# EAGLE schematic main_board (EAGLE 9.2.1)

## Sheet 1 of 2: LOGIC
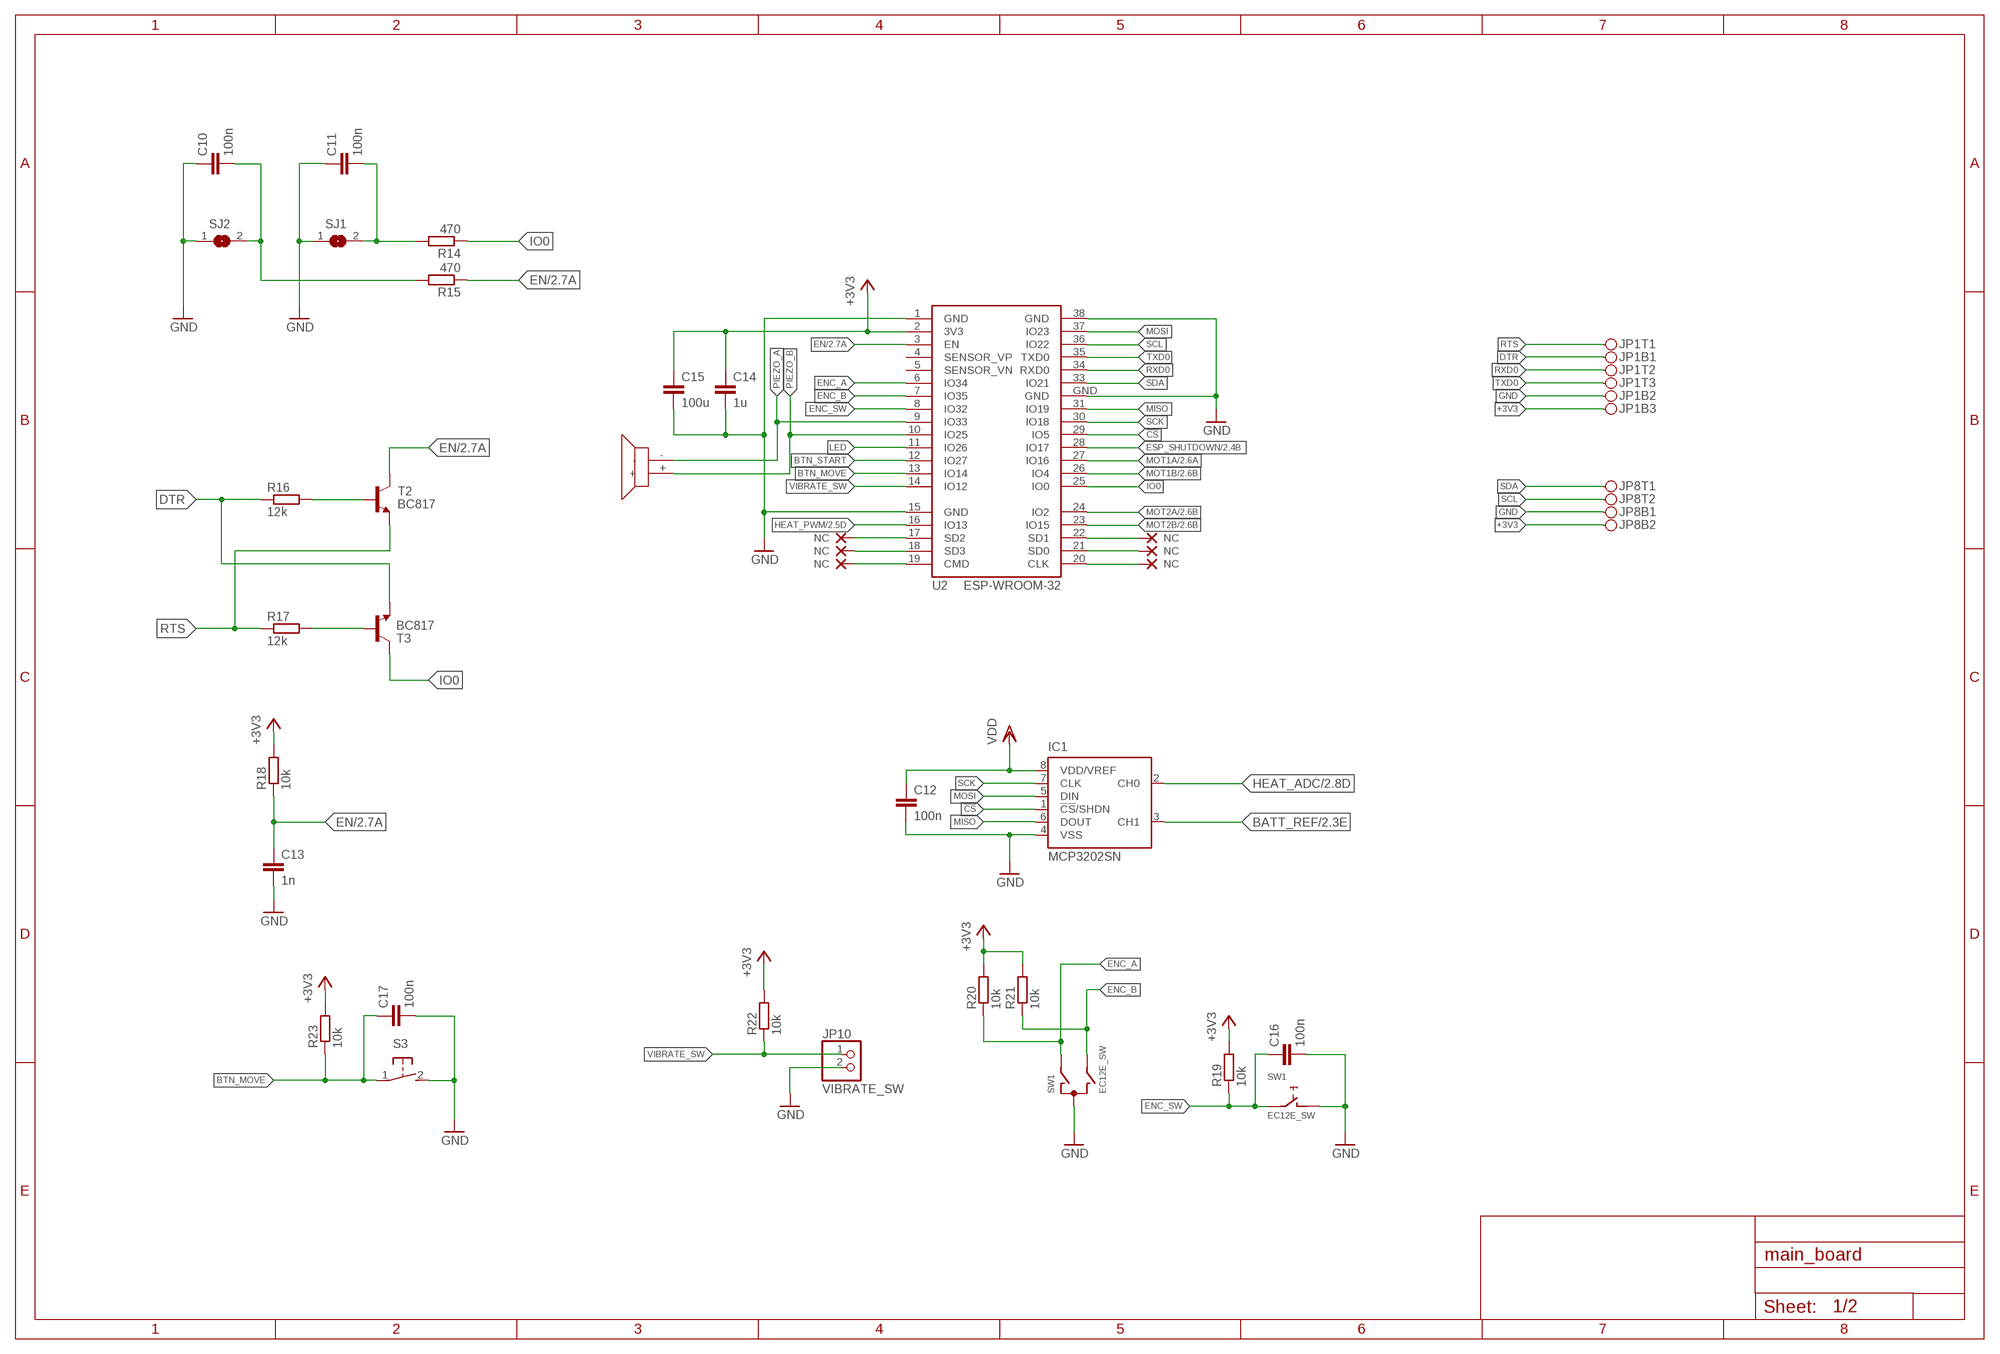
[diagram p0: schematic, sheet 1]

### Parts
C10  100n  C-EUC0603  [C0603]
C11  100n  C-EUC0603  [C0603]
C12  100n  C-EUC0603  [C0603]
C13  1n  C-EUC0603  [C0603]
C14  1u  C-EUC0603  [C0603]
C15  100u  C-EUC0603  [C0603]
C16  100n  C-EUC0603  [C0603]
C17  100n  C-EUC0603  [C0603]
IC1  MCP3202SN  [SO-08]
JP1  PINH2X03  [PINH2X03SMD]
JP8  PINH2X02  [PINH2X02SMD]
JP10  VIBRATE_SW  PINHD-1X2  [1X02]
NC2  NC  (no package)
NC3  NC  (no package)
NC4  NC  (no package)
NC5  NC  (no package)
NC6  NC  (no package)
NC7  NC  (no package)
R14  470  R-EU_R0603  [R0603]
R15  470  R-EU_R0603  [R0603]
R16  12k  R-EU_R0603  [R0603]
R17  12k  R-EU_R0603  [R0603]
R18  10k  R-EU_R0603  [R0603]
R19  10k  R-EU_R0603  [R0603]
R20  10k  R-EU_R0603  [R0603]
R21  10k  R-EU_R0603  [R0603]
R22  10k  R-EU_R0603  [R0603]
R23  10k  R-EU_R0603  [R0603]
S3  31-XX  [B3F-31XX]
SJ1  SJ  [SJ]
SJ2  SJ  [SJ]
SW1  EC12E_SW  [ALPS_EC12E_SW]
T2  BC817  BC817-25-NPN-SOT23-BEC  [SOT23-BEC]
T3  BC817  BC817-25-NPN-SOT23-BEC  [SOT23-BEC]
U2  ESP-WROOM-32  [ESP-WROOM-32]
U$1  PIEZO  [PIEZO]

### Nets
!CS: IC1.1(!CS!/SHDN) U2.29(IO5)
+3V3: C14.1 C15.1 JP1.B3 JP8.B2 R18.2 R19.2 R20.2 R21.2 R22.2 R23.2 U2.2(3V3) ; also sheet 2
BATT_REF: IC1.3(CH1) ; also sheet 2
BTN_MOVE: C17.1 R23.1 S3.1(P) U2.13(IO14)
BTN_START: U2.12(IO27)
DTR: JP1.B1 R16.1 T3.E
EN: C13.1 R15.1 R18.1 T2.C U2.3(EN) ; also sheet 2
ENC_A: R20.1 SW1.A U2.6(IO34)
ENC_B: R21.1 SW1.B U2.7(IO35)
ENC_SW: C16.1 R19.1 SW1.E U2.8(IO32)
ESP_SHUTDOWN: U2.28(IO17) ; also sheet 2
GND: C10.1 C11.1 C12.2 C13.2 C14.2 C15.2 C16.2 C17.2 IC1.4(VSS) JP1.B2 JP8.B1 JP10.2 S3.2(S) SJ1.1 SJ2.1 SW1.C SW1.D U2.1(GND) U2.15(GND) U2.38(GND) U2.GND ; also sheet 2
HEAT_ADC: IC1.2(CH0) ; also sheet 2
HEAT_PWM: U2.16(IO13) ; also sheet 2
IO0: R14.1 T3.C U2.25(IO0)
LED: U2.11(IO26)
MISO: IC1.6(DOUT) U2.31(IO19)
MOSI: IC1.5(DIN) U2.37(IO23)
MOT1A: U2.27(IO16) ; also sheet 2
MOT1B: U2.26(IO4) ; also sheet 2
MOT2A: U2.24(IO2) ; also sheet 2
MOT2B: U2.23(IO15) ; also sheet 2
N$12: R16.2 T2.B
N$20: C10.2 R15.2 SJ2.2
N$21: R17.2 T3.B
N$23: C11.2 R14.2 SJ1.2
N$24: NC5.NC U2.22(SD1)
N$25: NC2.NC U2.17(SD2)
N$26: NC3.NC U2.18(SD3)
N$27: NC4.NC U2.19(CMD)
N$28: NC6.NC U2.21(SD0)
N$29: NC7.NC U2.20(CLK)
PIEZO_A: U2.9(IO33) U$1.-
PIEZO_B: U2.10(IO25) U$1.+
RTS: JP1.T1 R17.1 T2.E
RXD0: JP1.T2 U2.34(RXD0)
SCK: IC1.7(CLK) U2.30(IO18)
SCL: JP8.T2 U2.36(IO22)
SDA: JP8.T1 U2.33(IO21)
TXD0: JP1.T3 U2.35(TXD0)
VDD: C12.1 IC1.8(VDD/VREF) ; also sheet 2
VIBRATE_SW: JP10.1 R22.1 U2.14(IO12)
Unconnected: SW1.GND1(G) SW1.GND2(G) U2.4(SENSOR_VP) U2.5(SENSOR_VN)

## Sheet 2 of 2: POWER
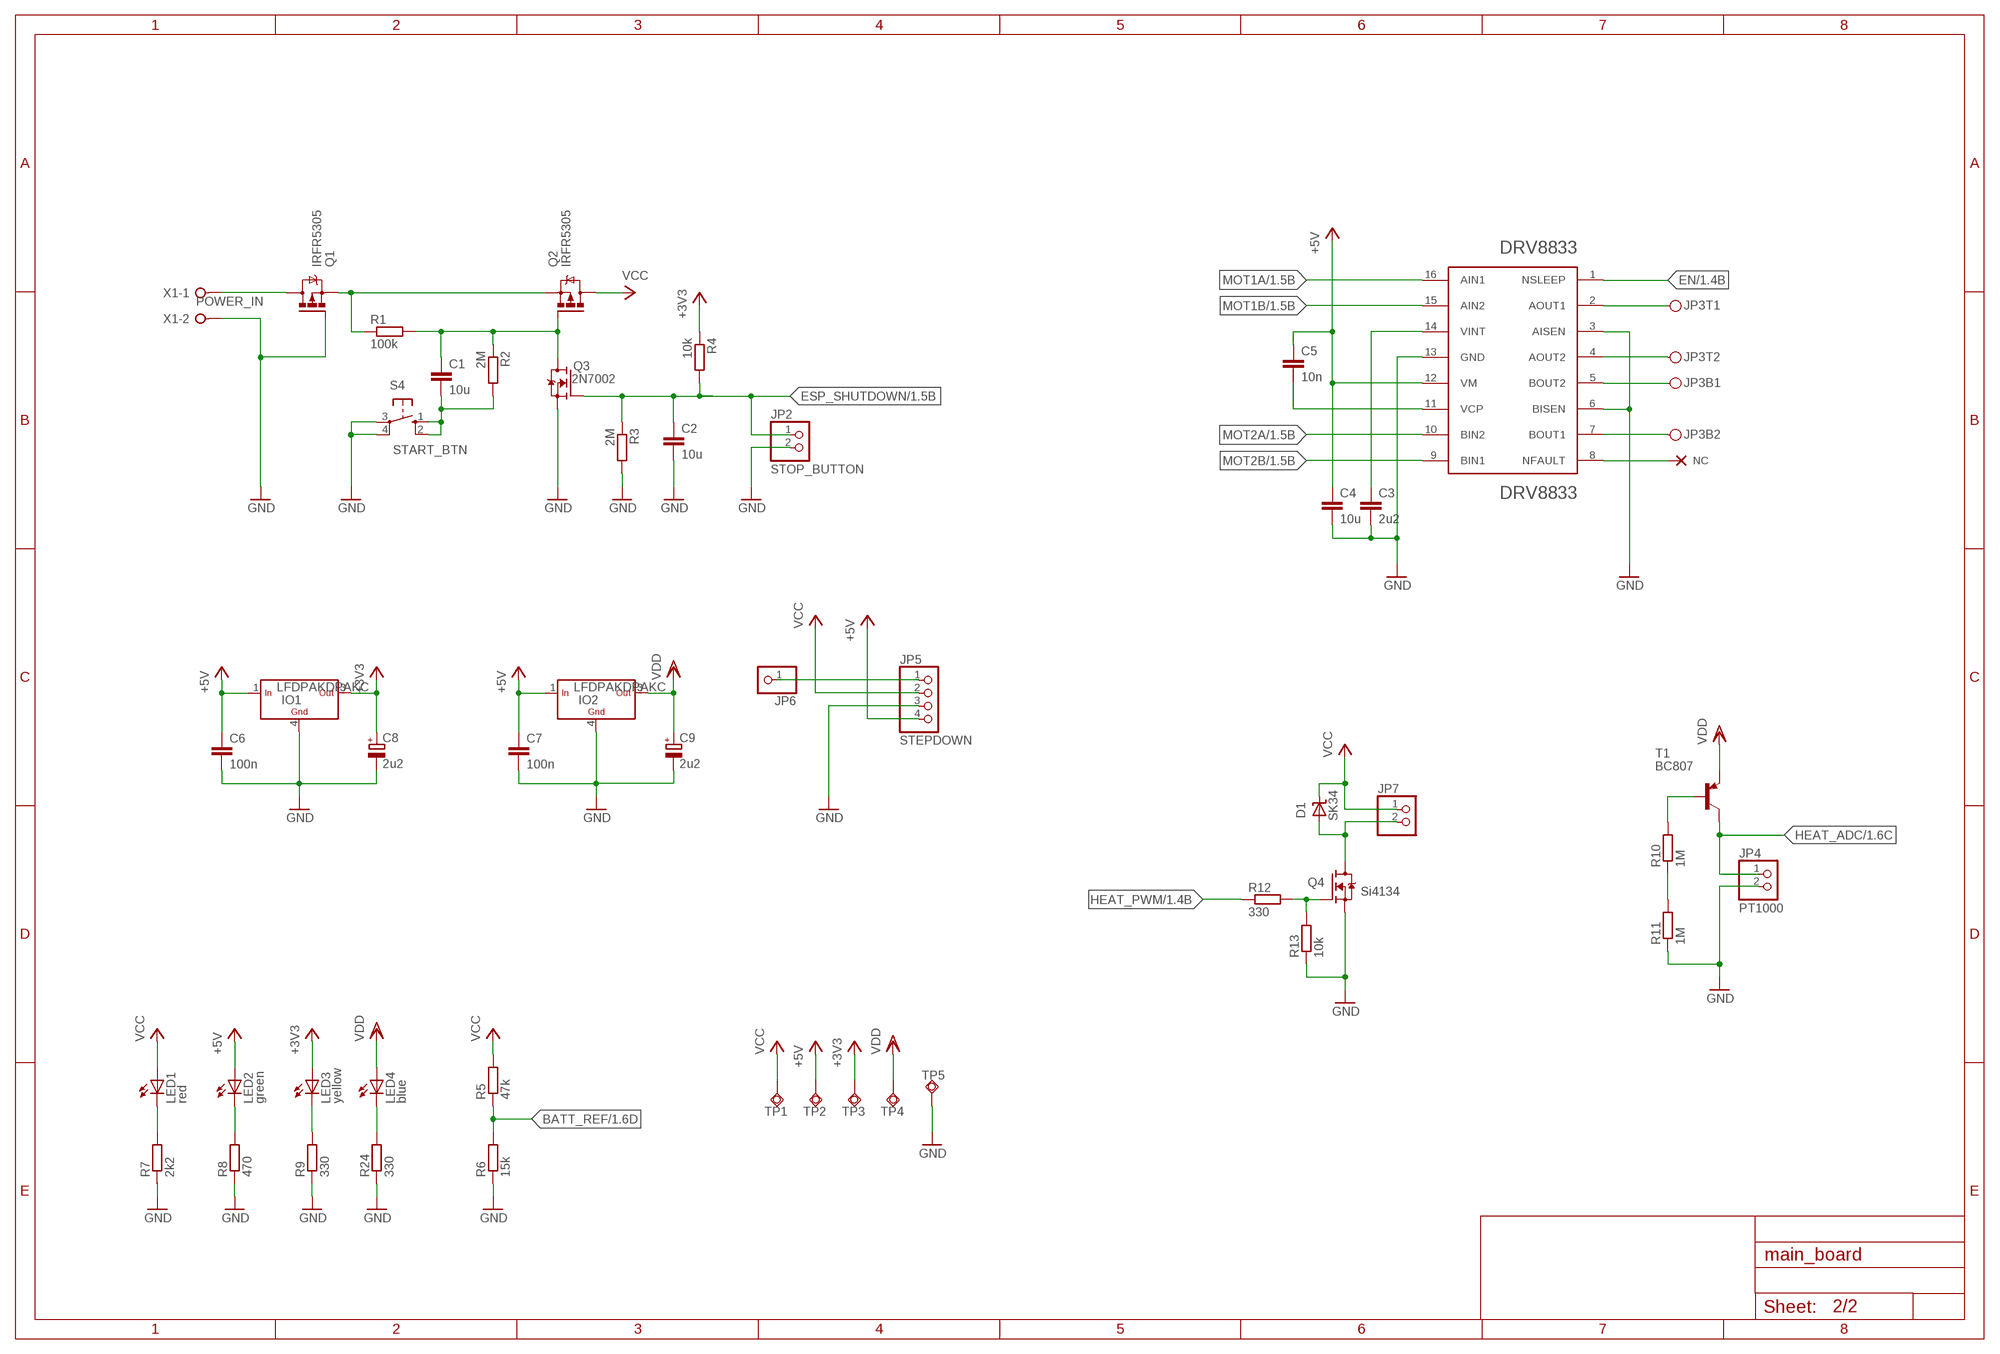
[diagram p1: schematic, sheet 2]

### Parts
C1  10u  C-EUC0805  [C0805]
C2  10u  C-EUC0805  [C0805]
C3  2u2  C-EUC0603  [C0603]
C4  10u  C-EUC1206  [C1206]
C5  10n  C-EUC0603  [C0603]
C6  100n  C-EUC0603  [C0603]
C7  100n  C-EUC0603  [C0603]
C8  2u2  CPOL-EUUD-4X5,8  [UD-4X5,8_NICHICON]
C9  2u2  CPOL-EUUD-4X5,8  [UD-4X5,8_NICHICON]
D1  SK34  SHOTTKY-SMB  [SMB]
DRV8833PWP1  DRV8833  [SOP65P640X120-17N]
IO1  LFDPAKDPAKC  [DPAK]
IO2  LFDPAKDPAKC  [DPAK]
JP2  STOP_BUTTON  PINHD-1X2  [1X02]
JP3  PINH2X02  [PINH2X02SMD]
JP4  PT1000  PINHD-1X2  [1X02]
JP5  STEPDOWN  PINHD-1X4  [1X04]
JP6  PINHD-1X1  [1X01]
JP7  PINHD-1X2  [1X02]
LED1  red  LEDCHIP-LED0603  [CHIP-LED0603]
LED2  green  LEDCHIP-LED0603  [CHIP-LED0603]
LED3  yellow  LEDCHIP-LED0603  [CHIP-LED0603]
LED4  blue  LEDCHIP-LED0603  [CHIP-LED0603]
NC1  NC  (no package)
Q1  IRFR5305  [D-PAK_TO252AA]
Q2  IRFR5305  [D-PAK_TO252AA]
Q3  2N7002  N-MOSFET-SOT23-GSD  [SOT23]
Q4  Si4134  N-MOSFET-SO8  [SO-8]
R1  100k  R-EU_R0603  [R0603]
R2  2M  R-EU_R0603  [R0603]
R3  2M  R-EU_R0603  [R0603]
R4  10k  R-EU_R0603  [R0603]
R5  47k  R-EU_R0603  [R0603]
R6  15k  R-EU_R0603  [R0603]
R7  2k2  R-EU_R0603  [R0603]
R8  470  R-EU_R0603  [R0603]
R9  330  R-EU_R0603  [R0603]
R10  1M  R-EU_R0603  [R0603]
R11  1M  R-EU_R0603  [R0603]
R12  330  R-EU_R0603  [R0603]
R13  10k  R-EU_R0603  [R0603]
R24  330  R-EU_R0603  [R0603]
S4  START_BTN  10-XX  [B3F-10XX]
T1  BC807  BC807-25-PNP-SOT23-BEC  [SOT23-BEC]
TP1  TPSQTP20SQ  [TP20SQ]
TP2  TPSQTP20SQ  [TP20SQ]
TP3  TPSQTP20SQ  [TP20SQ]
TP4  TPSQTP20SQ  [TP20SQ]
TP5  TPSQTP20SQ  [TP20SQ]
X1  POWER_IN  W237-02P  [W237-132]

### Nets
+3V3: C8.+ IO1.3(OUT) LED3.A R4.1 TP3.TP ; also sheet 1
+5V: C4.1 C5.1 C6.1 C7.1 DRV8833PWP1.12(VM) IO1.1(IN) IO2.1(IN) JP5.4 LED2.A TP2.TP
BATT_REF: R5.1 R6.2 ; also sheet 1
EN: DRV8833PWP1.1(NSLEEP) ; also sheet 1
ESP_SHUTDOWN: C2.1 JP2.1 Q3.1(G) R3.1 R4.2 ; also sheet 1
GND: C2.2 C3.2 C4.2 C6.2 C7.2 C8.- C9.- DRV8833PWP1.3(AISEN) DRV8833PWP1.6(BISEN) DRV8833PWP1.13(GND) IO1.4(GND) IO2.4(GND) JP2.2 JP4.2 JP5.3 Q1.1(G) Q3.2(S) Q4.1(S) Q4.2(S) Q4.3(S) R3.2 R6.1 R7.1 R8.1 R9.1 R11.1 R13.1 R24.1 S4.3(P) S4.4(P1) TP5.TP X1.2 ; also sheet 1
HEAT_ADC: JP4.1 T1.C ; also sheet 1
HEAT_PWM: R12.1 ; also sheet 1
MOT1A: DRV8833PWP1.16(AIN1) ; also sheet 1
MOT1B: DRV8833PWP1.15(AIN2) ; also sheet 1
MOT2A: DRV8833PWP1.10(BIN2) ; also sheet 1
MOT2B: DRV8833PWP1.9(BIN1) ; also sheet 1
N$1: Q1.3(S) Q2.3(S) R1.1
N$2: C1.1 Q2.1(G) Q3.3(D) R1.2 R2.1
N$3: LED4.C R24.2
N$4: Q1.4(D) X1.1
N$5: LED3.C R9.2
N$6: LED2.C R8.2
N$7: LED1.C R7.2
N$8: DRV8833PWP1.2(AOUT1) JP3.T1
N$9: DRV8833PWP1.4(AOUT2) JP3.T2
N$10: DRV8833PWP1.5(BOUT2) JP3.B1
N$11: DRV8833PWP1.7(BOUT1) JP3.B2
N$13: C3.1 DRV8833PWP1.14(VINT)
N$14: JP5.1 JP6.1
N$15: C5.2 DRV8833PWP1.11(VCP)
N$16: D1.A JP7.2 Q4.5(D) Q4.6(D) Q4.7(D) Q4.8(D)
N$17: DRV8833PWP1.8(NFAULT) NC1.NC
N$18: R10.1 R11.2
N$19: R10.2 T1.B
N$22: Q4.4(G) R12.2 R13.2
N$30: C1.2 R2.2 S4.1(S) S4.2(S1)
VCC: D1.C JP5.2 JP7.1 LED1.A Q2.4(D) R5.2 TP1.TP
VDD: C9.+ IO2.3(OUT) LED4.A T1.E TP4.TP ; also sheet 1

## Library data of the parts
C1-C7 C10-C17 = rcl_upravena:C-EU: CAPACITOR, European symbol
C8 C9 = rcl_upravena:CPOL-EU: POLARIZED CAPACITOR, European symbol
D1 = diode:SHOTTKY
DRV8833PWP1 = DRV8833PWP:DRV8833
IC1 = microchip:MCP3202: 2.7V Dual Channel 12-Bit A/D Converter with SPI Serial Interface Source: http://ww1.microchip.com/downloads/en/DeviceDoc/21034D.pdf; MF: MICROCHIP; MPN: MCP3202-CI/SN; OC_FARNELL: 1196803; OC_NEWARK: 19C7207
IO1 IO2 = #PaJa_30:LF??C: LF??C - stabilizátory low-drop výstup dle typu 1,25 - 12V
JP1 = pinhead_smd:PINH2X03
JP2 JP4 JP7 JP10 = pinhead:PINHD-1X2: PIN HEADER
JP3 JP8 = pinhead_smd:PINH2X02
JP5 = pinhead:PINHD-1X4: PIN HEADER
JP6 = pinhead:PINHD-1X1: PIN HEADER
LED1-LED4 = led:LED: LED OSRAM: - CHIPLED LG R971, LG N971, LY N971, LG Q971, LY Q971, LO R971, LY R971 LH N974, LH R974 LS Q976, LO Q976, LY Q976 LO Q996 - Hyper CHIPLED LW Q18S LB Q993, LB Q99A, LB R99A - SideLED LS A670, LO A670, LY A670, LG A670, LP A670 LB A673, LV A673, LT A673, LW A673 LH A674 LY A675 LS A676, LA A676, LO A676, LY A676, LW A676 LS A679, LY A679, LG A679 - Hyper Micro SIDELED® LS Y876, LA Y876, LO Y876, LY Y876 LT Y87S - SmartLED LW L88C, LW L88S LB L89C, LB L89S, LG L890 LS L89K, LO L89K, LY L89K LS L896, LA L896, LO L896, LY L896 - TOPLED LS T670, LO T670, LY T670, LG T670, LP T670 LSG T670, LSP T670, LSY T670, LOP T670, LYG T670 LG T671, LOG T671, LSG T671 LB T673, LV T673, LT T673, LW T673 LH T674 LS T676, LA T676, LO T676, LY T676, LB T676, LH T676, LSB T676, LW T676 LB T67C, LV T67C, LT T67C, LS T67K, LO T67K, LY T67K, LW E67C LS E67B, LA E67B, LO E67B, LY E67B, LB E67C, LV E67C, LT E67C LW T67C LS T679, LY T679, LG T679 LS T770, LO T770, LY T770, LG T770, LP T770 LB T773, LV T773, LT T773, LW T773 LH T774 LS E675, LA E675, LY E675, LS T675 LS T776, LA T776, LO T776, LY T776, LB T776 LHGB T686 LT T68C, LB T68C - Hyper Mini TOPLED® LB M676 - Mini TOPLED Santana® LG M470 LS M47K, LO M47K, LY M47K Source: http://www.osram.convergy.de LUXEON: - LUMILED® LXK2-PW12-R00, LXK2-PW12-S00, LXK2-PW14-U00, LXK2-PW14-V00 LXK2-PM12-R00, LXK2-PM12-S00, LXK2-PM14-U00 LXK2-PE12-Q00, LXK2-PE12-R00, LXK2-PE12-S00, LXK2-PE14-T00, LXK2-PE14-U00 LXK2-PB12-K00, LXK2-PB12-L00, LXK2-PB12-M00, LXK2-PB14-N00, LXK2-PB14-P00, LXK2-PB14-Q00 LXK2-PR12-L00, LXK2-PR12-M00, LXK2-PR14-Q00, LXK2-PR14-R00 LXK2-PD12-Q00, LXK2-PD12-R00, LXK2-PD12-S00 LXK2-PH12-R00, LXK2-PH12-S00 LXK2-PL12-P00, LXK2-PL12-Q00, LXK2-PL12-R00 Source: www.luxeon.com KINGBRIGHT: KA-3528ASYC Source: www.kingbright.com
NC1-NC7 = NC:NC: _EXTERNAL_
Q1 Q2 = transistor-power:IRF?5305: HEXFET Power MOSFET Source: http://www.irf.com/product-info/datasheets/data/irfr5305pbf.pdf
Q3 Q4 = transistors:N-MOSFET
R1-R24 = rcl_upravena:R-EU_: RESISTOR, European symbol
S3 = switch-omron:31-XX: OMRON SWITCH; MPN: B3F-3100; OC_FARNELL: 959704; OC_NEWARK: 36M3582
S4 = switch-omron:10-XX: OMRON SWITCH; MPN: B3F-1000; OC_FARNELL: 176432; OC_NEWARK: 36M3542
SJ1 SJ2 = jumper:SJ: SMD solder JUMPER
SW1 = switch-alps:EC12E_SW: ALPS rotary Encoder EC12E series with switch; MPN: EC12E2424407; OC_FARNELL: 1520813; OC_NEWARK: 74M1068
T1 = transistor:*-PNP-: PNP Transistror
T2 T3 = transistor:*-NPN-: NPN Transistror BF959 corrected 2008.03.06
TP1-TP5 = testpad:TPSQ: Test pad
U2 = esp32:ESP-WROOM-32: Espressif Systems ESP-WROOM-32
U$1 = piezo:PIEZO
X1 = con-wago-508:W237-02P: WAGO SREW CLAMP; OC_FARNELL: unknown; OC_NEWARK: unknown